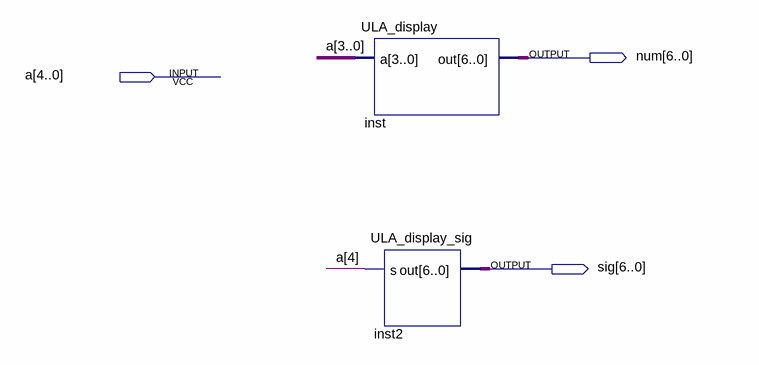
[diagram p0: schematic sheet]
// Quartus schematic ULA_display5b.bdf as structural Verilog: 2 symbols, 3 pins
module ULA_display5b (
  input  [4:0] a,
  output [6:0] num,
  output [6:0] sig
);

  ULA_display inst (.a(a[3:0]), .out(num));
  ULA_display_sig inst2 (.s(a[4]), .out(sig));
endmodule
